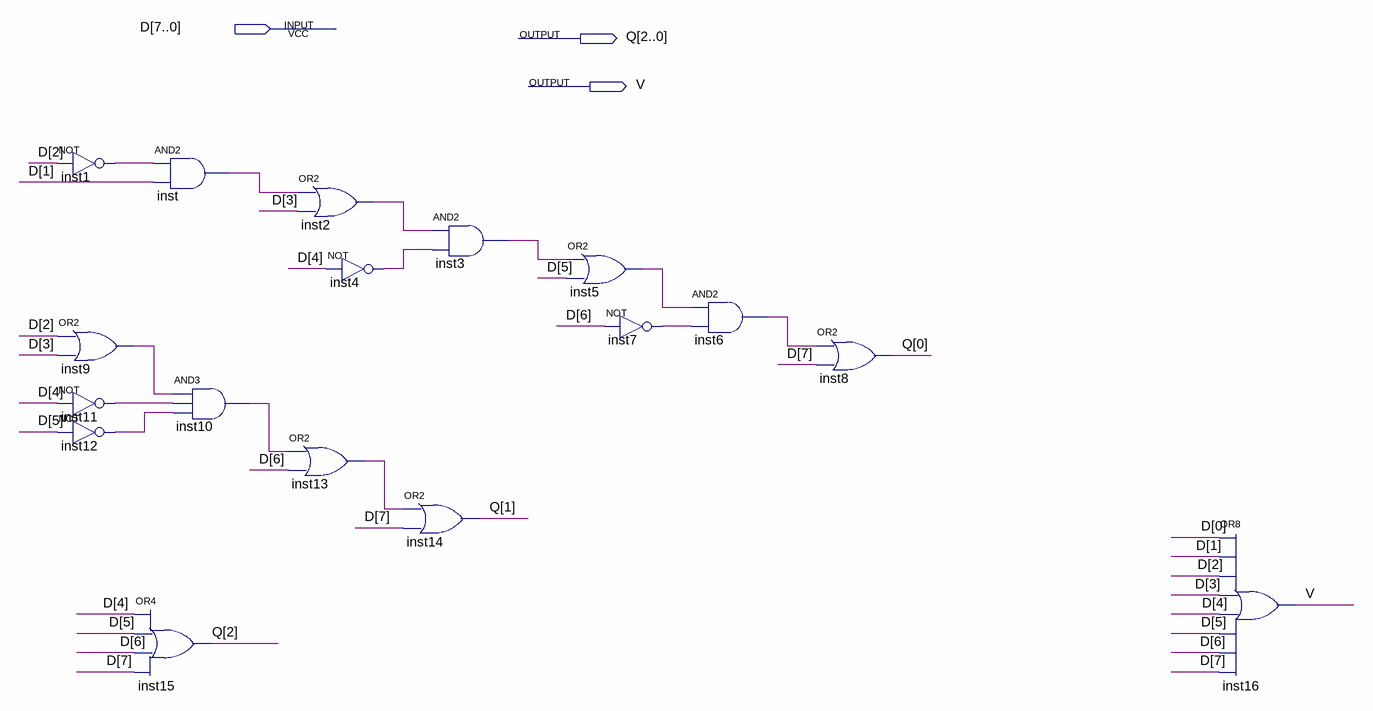
[diagram p0: schematic sheet]
// Quartus schematic COD.bdf as structural Verilog: 17 symbols, 3 pins
module COD (
  input  [7:0] D,
  output [2:0] Q,
  output V
);

  wire inst1_out, inst2_out, inst3_out, inst4_out, inst5_out, inst6_out, inst7_out, inst9_out, inst10_out,
       inst11_out, inst12_out, inst13_out, inst_out;

  not inst1 (inst1_out, D[2]);
  or inst9 (inst9_out, D[2], D[3]);
  not inst11 (inst11_out, D[4]);
  not inst12 (inst12_out, D[5]);
  or inst15 (Q[2], D[4], D[5], D[6], D[7]);
  and inst (inst_out, inst1_out, D[1]);
  and inst10 (inst10_out, inst9_out, inst11_out, inst12_out);
  or inst13 (inst13_out, inst10_out, D[6]);
  or inst2 (inst2_out, inst_out, D[3]);
  not inst4 (inst4_out, D[4]);
  and inst3 (inst3_out, inst2_out, inst4_out);
  or inst14 (Q[1], inst13_out, D[7]);
  or inst5 (inst5_out, inst3_out, D[5]);
  not inst7 (inst7_out, D[6]);
  and inst6 (inst6_out, inst5_out, inst7_out);
  or inst8 (Q[0], inst6_out, D[7]);
  or inst16 (V, D[0], D[1], D[2], D[3], D[4], D[5], D[6], D[7]);
endmodule
